# EAGLE design quasi_bb_nano_controller (EAGLE 9.4.2)
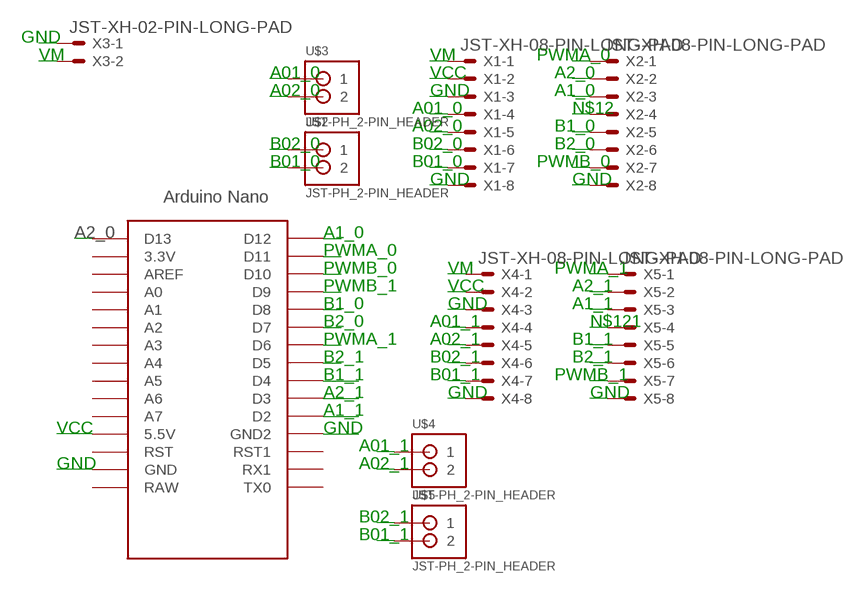
[diagram p0: schematic, sheet 1]

## Parts
U$1  NANO  [NANO]
U$2  JST-PH_2-PIN_HEADER  [JST_B2B-PH_HEADER]
U$3  JST-PH_2-PIN_HEADER  [JST_B2B-PH_HEADER]
U$4  JST-PH_2-PIN_HEADER  [JST_B2B-PH_HEADER]
U$5  JST-PH_2-PIN_HEADER  [JST_B2B-PH_HEADER]
X1  JST-XH-08-PIN-LONG-PAD  [JST-XH-08-PACKAGE-LONG-PAD]
X2  JST-XH-08-PIN-LONG-PAD  [JST-XH-08-PACKAGE-LONG-PAD]
X3  JST-XH-02-PIN-LONG-PAD  [JST-XH-02-PACKAGE-LONG-PAD]
X4  JST-XH-08-PIN-LONG-PAD  [JST-XH-08-PACKAGE-LONG-PAD]
X5  JST-XH-08-PIN-LONG-PAD  [JST-XH-08-PACKAGE-LONG-PAD]

## Nets
A01_0: U$3.P1 X1.4
A1_0: U$1.D12 X2.3
A01_1: U$4.P1 X4.4
A1_1: U$1.D2 X5.3
A02_0: U$3.P2 X1.5
A2_0: U$1.D13 X2.2
A02_1: U$4.P2 X4.5
A2_1: U$1.D3 X5.2
B01_0: U$2.P2 X1.7
B1_0: U$1.D8 X2.5
B01_1: U$5.P2 X4.7
B1_1: U$1.D4 X5.5
B02_0: U$2.P1 X1.6
B2_0: U$1.D7 X2.6
B02_1: U$5.P1 X4.6
B2_1: U$1.D5 X5.6
GND: U$1.GND U$1.GND1(GND2) X1.3 X1.8 X2.8 X3.1 X4.3 X4.8 X5.8
N$12: X2.4
N$121: X5.4
PWMA_0: U$1.D11 X2.1
PWMA_1: U$1.D6 X5.1
PWMB_0: U$1.D10 X2.7
PWMB_1: U$1.D9 X5.7
VCC: U$1.5V(5.5V) X1.2 X4.2
VM: X1.1 X3.2 X4.1
Unconnected: U$1.3.3V U$1.A0 U$1.A1 U$1.A2 U$1.A3 U$1.A4 U$1.A5 U$1.A6 U$1.A7 U$1.AREF U$1.ICSP1 U$1.ICSP2 U$1.ICSP3 U$1.ICSP4 U$1.ICSP5 U$1.ICSP6 U$1.RAW U$1.RST U$1.RST1 U$1.RX1 U$1.TX0

## Library data of the parts
U$1 = Arduino-clone:NANO: Arduino Nano
U$2-U$5 = con-jst-ph:JST-PH_2-PIN_HEADER: 2-pin JST PH Shrouded Header, top entry P/N B2B-PH-K-S Mating connector PHR-2 Mating cable assembly: Sparkfun PRT-09914 <http://www.sparkfun.com/products/9914>
X1 X2 X4 X5 = Rembrandt Electronics - JST XH Connectors v1-0:JST-XH-08-PIN: JST XH Connector 2 Pin Wire to board connector. Pitch: 2,54 mm, (0.100") Number of pins: 8 Created by Rembrandt Electronics www.rembrandtelectronics.com
X3 = Rembrandt Electronics - JST XH Connectors v1-0:JST-XH-02-PIN: JST XH Connector 2 Pin Wire to board connector. Pitch: 2,54 mm, (0.100") Number of pins: 2 Created by Rembrandt Electronics www.rembrandtelectronics.com

## Board
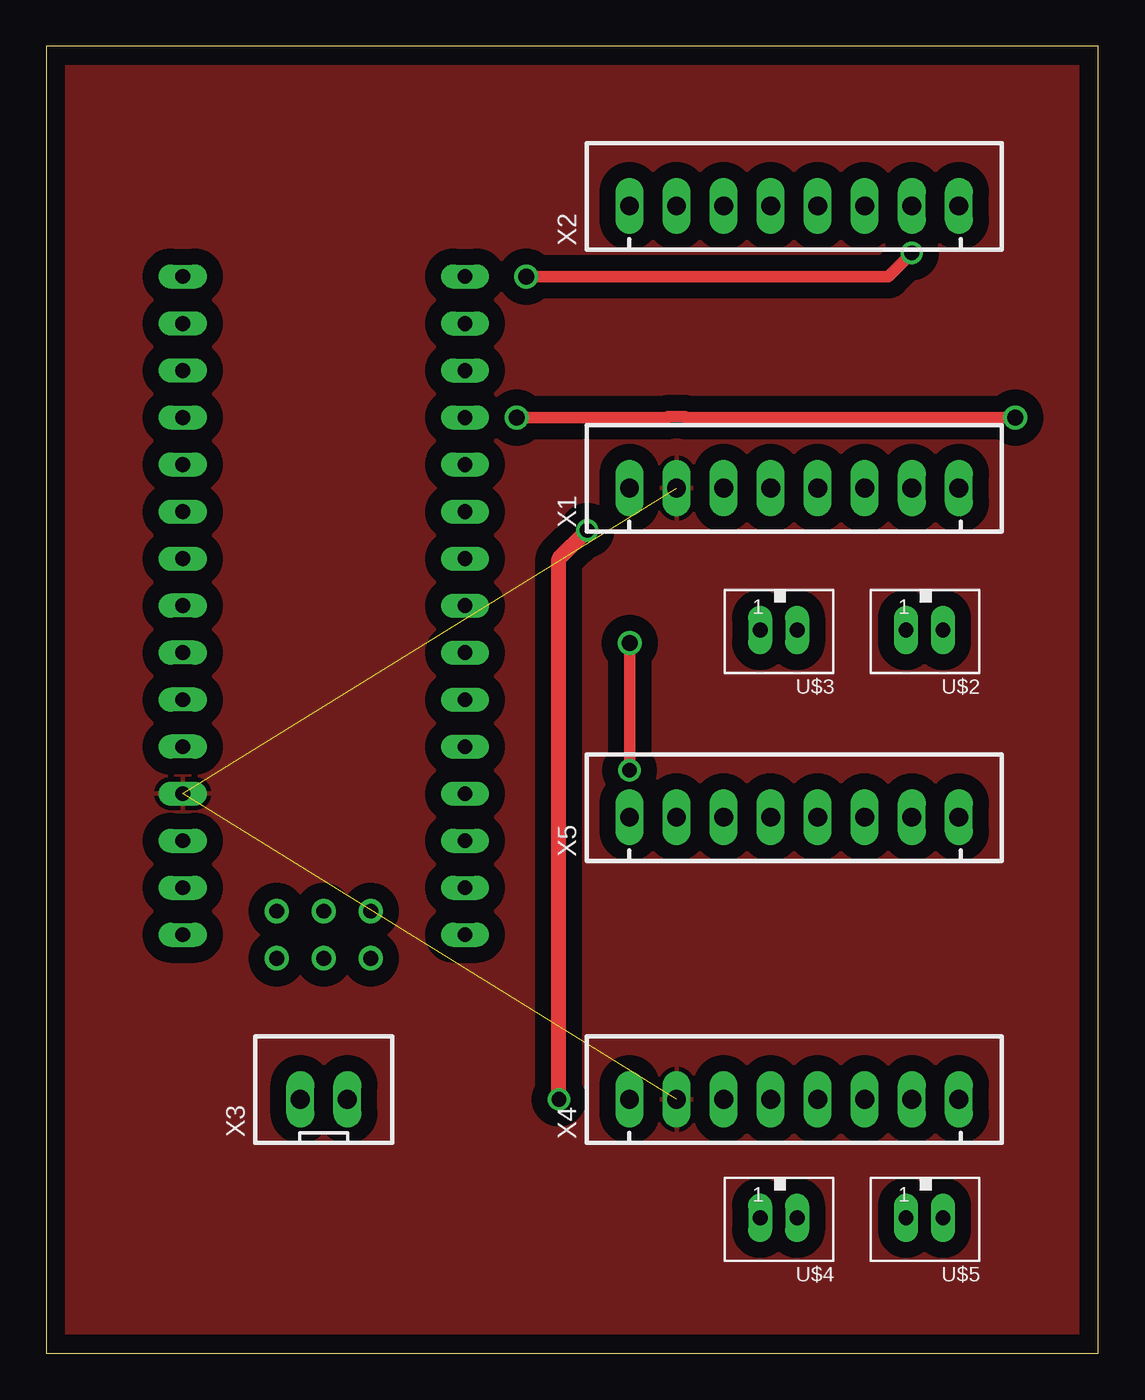
[diagram p1: board, top side]
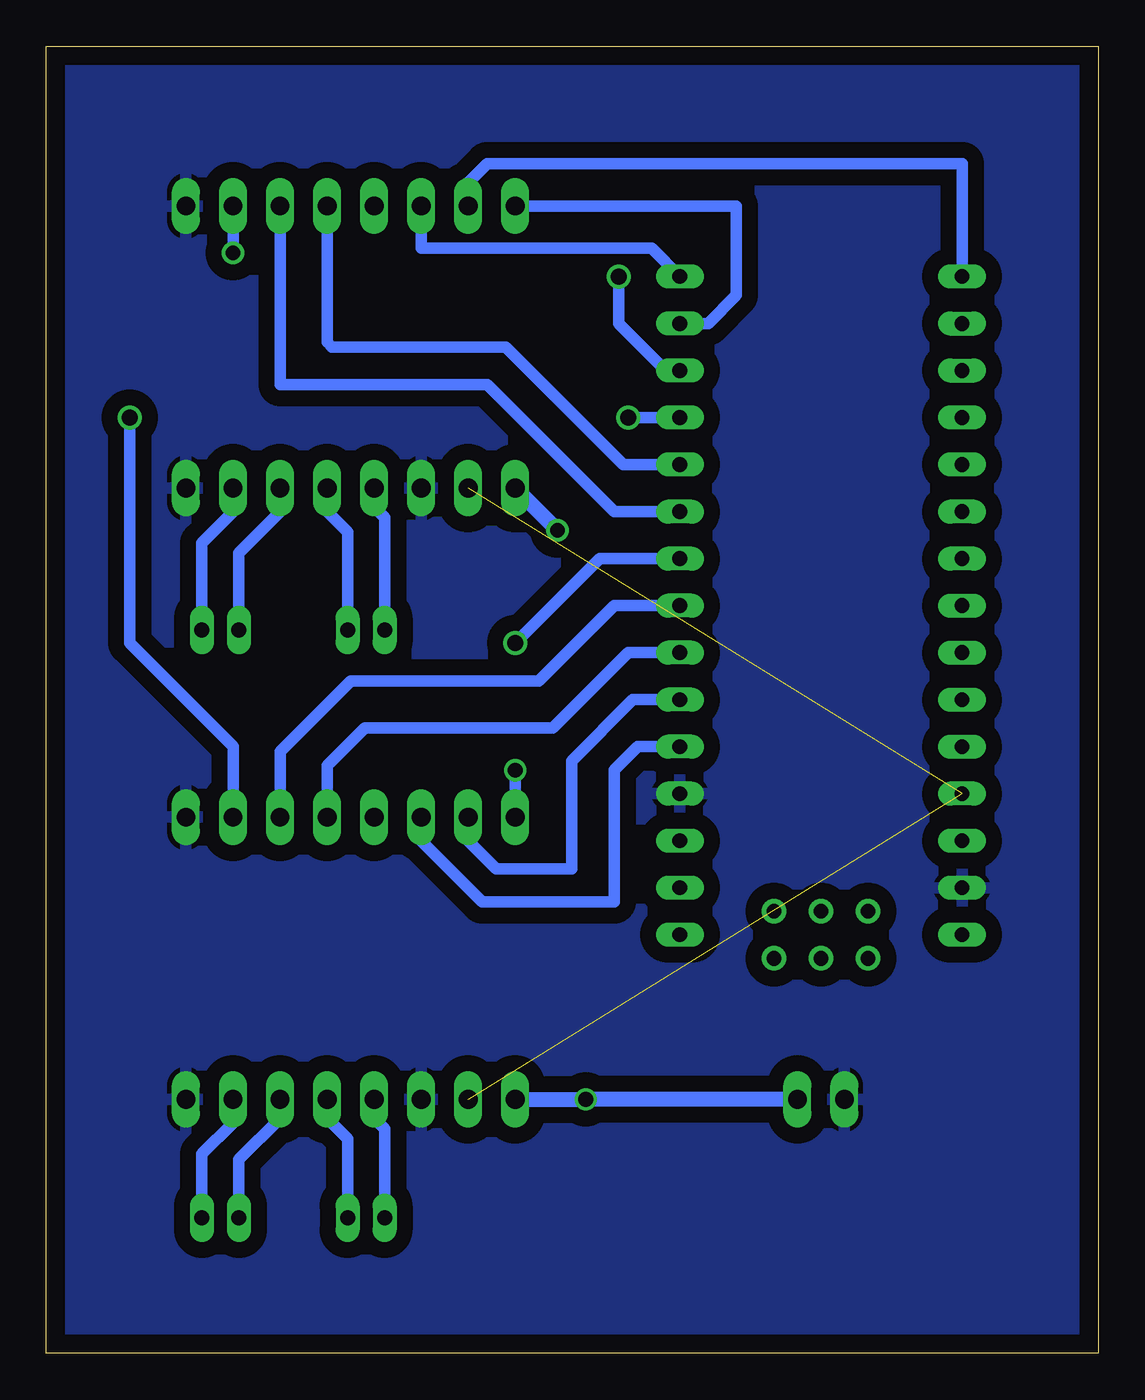
[diagram p2: board, bottom side, seen from below]

Size 56.82 x 70.6 mm. Coordinates in mm from the lower left corner, seen from the top.
Outline: 0,0 56.82,0 56.82,70.6 0,70.6 0,0
Copper layers (1*16): Top 0.035mm / dielectric 1.5mm / Bottom 0.035mm
Design rules "default": minimum track width 6mil, minimum drill 0.35mm, track to track 6mil, track to pad 6mil, pad to pad 6mil, via to via 6mil, smd to smd 6mil, copper to edge 40mil, drill to drill 6mil, minimum pad ring 10mil, minimum via ring 8mil, stop-mask expansion 4mil, vias tented up to drill 0mil, thermal gap 10mil

### Footprints (pad centres in the part's own frame; a part is rotated, then mirrored left to right if it is on the bottom)
NANO = drill 0.8 long: 3.3V -10.16,24.13; 5V -10.16,-1.27; A0 -10.16,19.05; A1 -10.16,16.51; A2 -10.16,13.97; A3 -10.16,11.43; A4 -10.16,8.89; A5 -10.16,6.35; A6 -10.16,3.81; A7 -10.16,1.27; AREF -10.16,21.59; D2 5.08,1.27; D3 5.08,3.81; D4 5.08,6.35; D5 5.08,8.89; D6 5.08,11.43; D7 5.08,13.97; D8 5.08,16.51; D9 5.08,19.05; D10 5.08,21.59; D11 5.08,24.13; D12 5.08,26.67; D13 -10.16,26.67; GND -10.16,-6.35; GND1 5.08,-1.27; RAW -10.16,-8.89; RST -10.16,-3.81; RST1 5.08,-3.81; RX1 5.08,-6.35; TX0 5.08,-8.89 | drill 0.8: ICSP1 -5.08,-10.16; ICSP2 -5.08,-7.62; ICSP3 -2.54,-10.16; ICSP4 -2.54,-7.62; ICSP5 0,-10.16; ICSP6 0,-7.62
JST_B2B-PH_HEADER = drill 0.8 long: P1 1.075,0.048; P2 -0.925,0.048
JST-XH-08-PACKAGE-LONG-PAD = drill 1.016 long: 1 -8.89,0; 2 -6.35,0; 3 -3.81,0; 4 -1.27,0; 5 1.27,0; 6 3.81,0; 7 6.35,0; 8 8.89,0
JST-XH-02-PACKAGE-LONG-PAD = drill 1.016 long: 1 -1.27,0; 2 1.27,0

### Placement (x,y rotation side)
U$1  17.53,31.5 0 top
U$2  47.5,39.12 180 top
U$3  39.62,39.12 180 top
U$4  39.62,7.37 180 top
U$5  47.5,7.37 180 top
X1  40.39,46.74 0 top
X2  40.39,61.98 0 top
X3  14.99,13.72 0 top
X4  40.39,13.72 0 top
X5  40.39,28.96 0 top

### Tracks (layer width: path | path; a pad name or v marks a point on that pad's centre or on a via)
A01_0
  Bottom 0.61: U$3.P1 38.55,45.15 39.12,45.72 X1.4
A1_0
  Bottom 0.61: X2.3 36.58,59.69 24.13,59.69 U$1.D12
A01_1
  Bottom 0.61: U$4.P1 38.55,12.13 39.12,12.7 X4.4
A1_1
  Bottom 0.61: X5.3 36.58,27.69 33.27,24.38 26.16,24.38 26.16,31.5 24.89,32.77 U$1.D2
A02_0
  Bottom 0.61: U$3.P2 40.55,44.36 41.66,45.47 X1.5
A2_0
  Bottom 0.61: U$1.D13 7.37,64.26 33.02,64.26 34.04,63.25 X2.2
A02_1
  Bottom 0.61: U$4.P2 40.55,11.59 41.66,12.7 X4.5
A2_1
  Bottom 0.61: U$1.D3 25.15,35.31 28.45,32 28.45,26.16 32.51,26.16 34.04,27.69 X5.2
B01_0
  Bottom 0.61: U$2.P2 48.42,43.78 46.74,45.47 X1.7
B1_0
  Bottom 0.61: U$1.D8 25.65,48.01 32,54.36 41.4,54.36 41.66,54.61 X2.5
B01_1
  Bottom 0.61: U$5.P2 48.42,10.76 46.74,12.45 X4.7
B1_1
  Bottom 0.61: U$1.D4 25.4,37.85 29.46,33.78 39.62,33.78 41.66,31.75 X5.5
B02_0
  Bottom 0.61: U$2.P1 46.42,43.24 44.2,45.47 X1.6
B2_0
  Bottom 0.61: U$1.D7 26.16,45.47 33.02,52.32 44.2,52.32 X2.6
B02_1
  Bottom 0.61: U$5.P1 46.42,10.47 44.2,12.7 X4.6
B2_1
  Bottom 0.61: U$1.D5 26.16,40.39 30.23,36.32 40.39,36.32 44.2,32.51 X5.6
GND
  pour Bottom (isolate 0.864): -3.05,73.15 -3.05,-2.29 -2.29,-3.05 63.5,-3.05 64.01,-2.54 64.01,73.15 63.25,73.91 -2.29,73.91
PWMA_0
  Bottom 0.61: U$1.D11 21.08,55.63 19.56,57.15 19.56,61.98 X2.1
PWMA_1  (via drill 0.8, 0.86)
  Top 0.61: v31.5,38.35 v31.5,31.5
  Bottom 0.61: X5.1 v31.5,31.5 | U$1.D6 26.92,42.93 v31.5,38.35
PWMB_0  (via drill 0.8, 0.86)
  Top 0.61: v46.74,59.44 45.47,58.17 v25.91,58.17
  Bottom 0.61: X2.7 v46.74,59.44 | U$1.D10 23.37,53.09 25.91,55.63 v25.91,58.17
PWMB_1  (via drill 0.86)
  Top 0.61: v52.32,50.55 34.52,50.55 34.48,50.59 33.6,50.59 33.55,50.55 v25.4,50.55
  Bottom 0.61: U$1.D9 v25.4,50.55 | X5.7 46.74,32.77 52.32,38.35 v52.32,50.55
VCC  (2 unrouted)
  pour Top (isolate 0.864): -5.33,77.22 64.52,77.22 64.52,-5.33 -5.33,-5.33
VM  (via drill 0.8)
  Top 0.813: v27.69,13.72 27.69,42.93 v29.21,44.45
  Bottom 0.813: v29.21,44.45 X1.1 | X3.2 v27.69,13.72 X4.1